# Altium project FuelCell.PrjPcb (part 1 of 3)
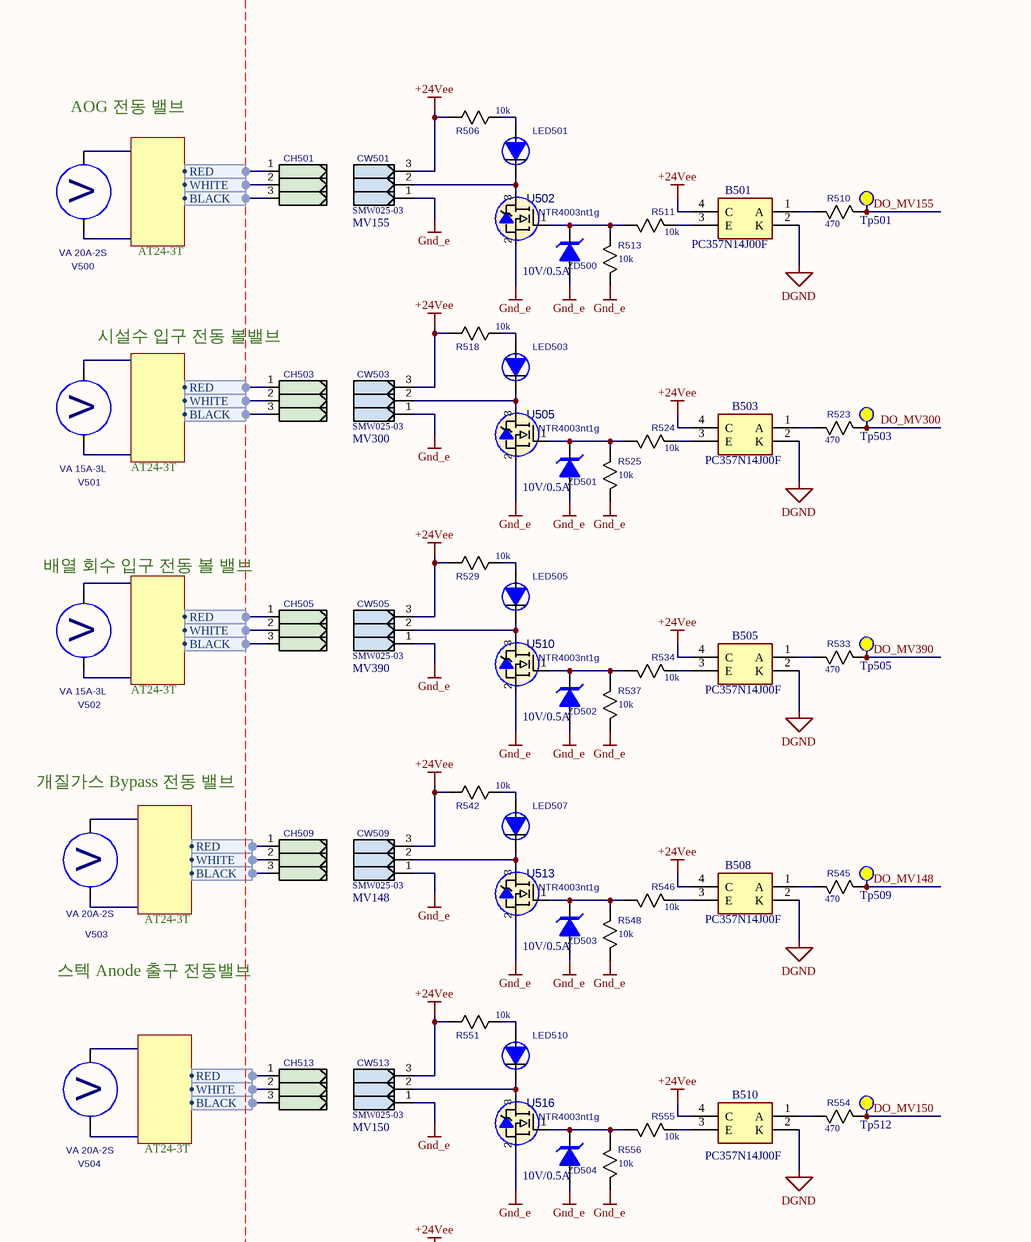
[diagram p0: Output_Section.SchDoc, top left]
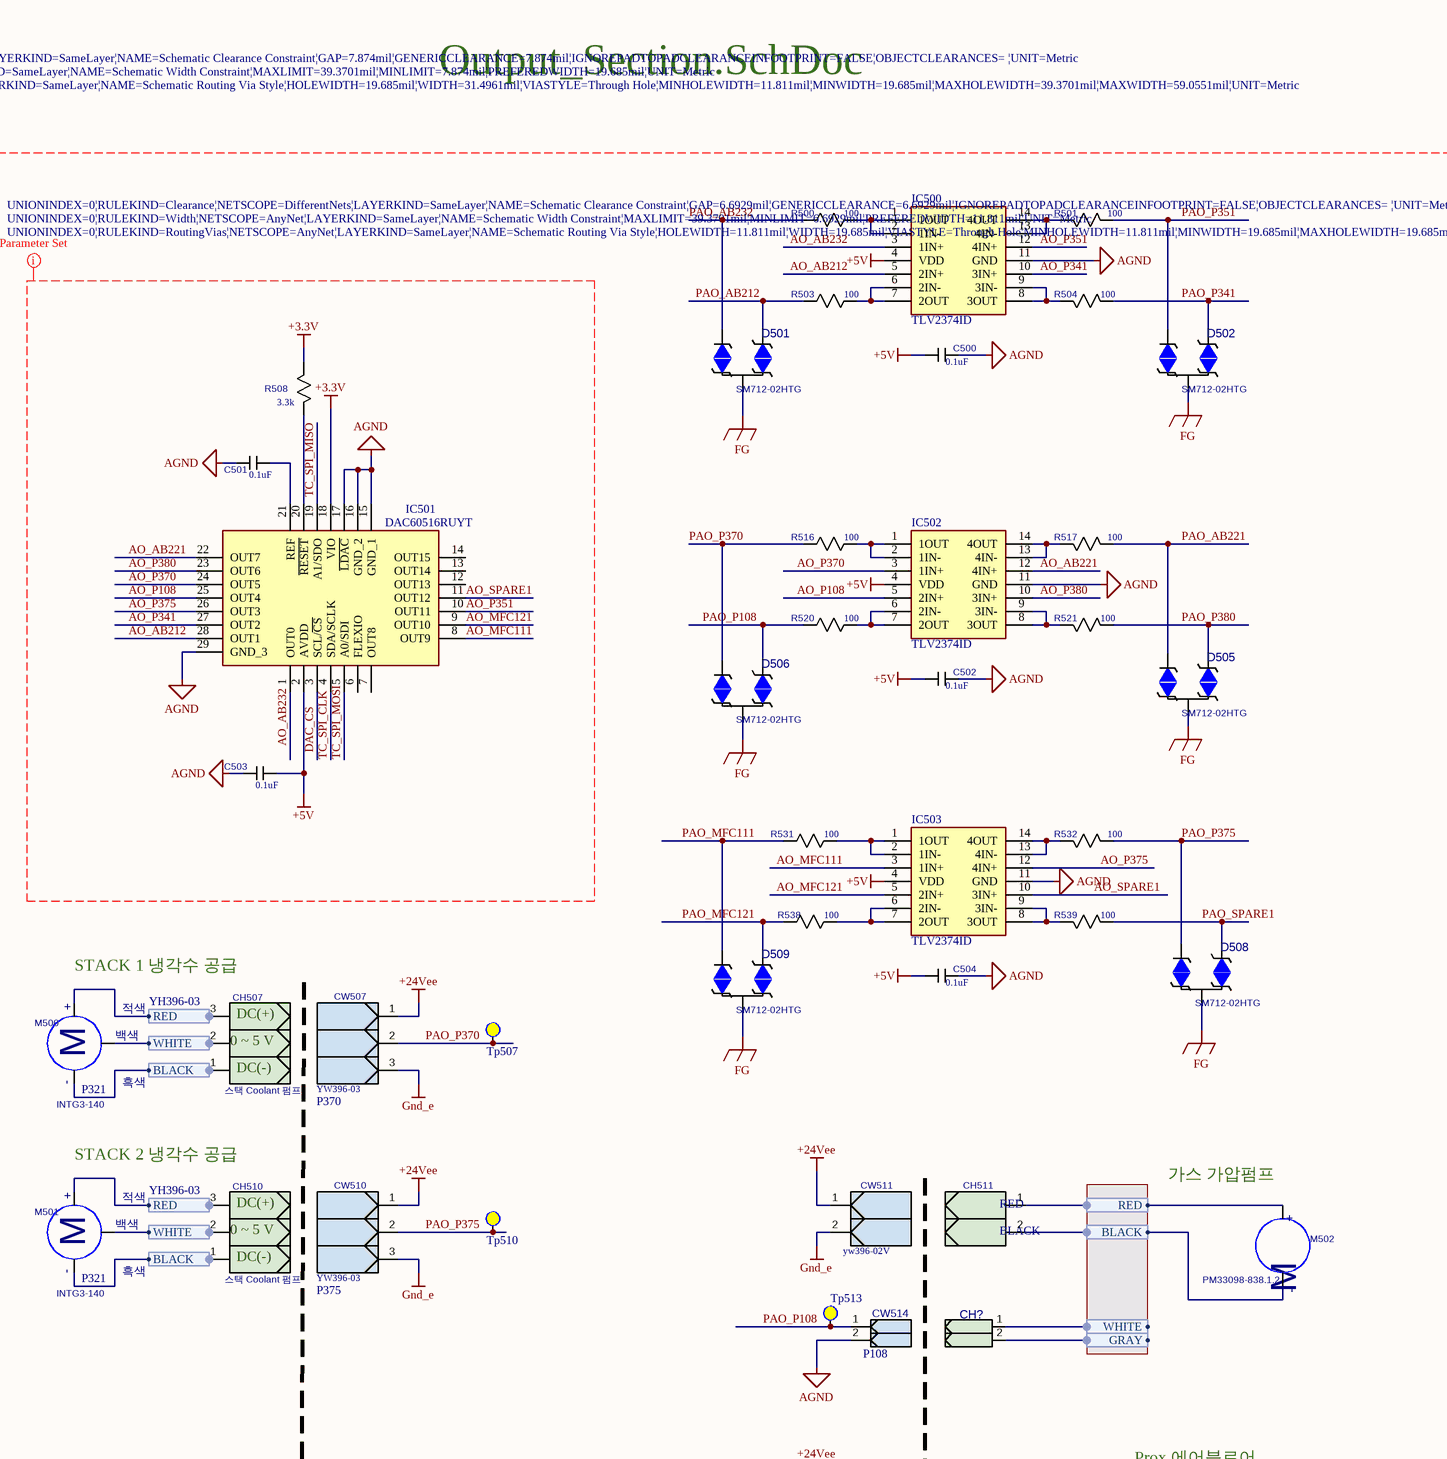
[diagram p1: Output_Section.SchDoc, top middle]
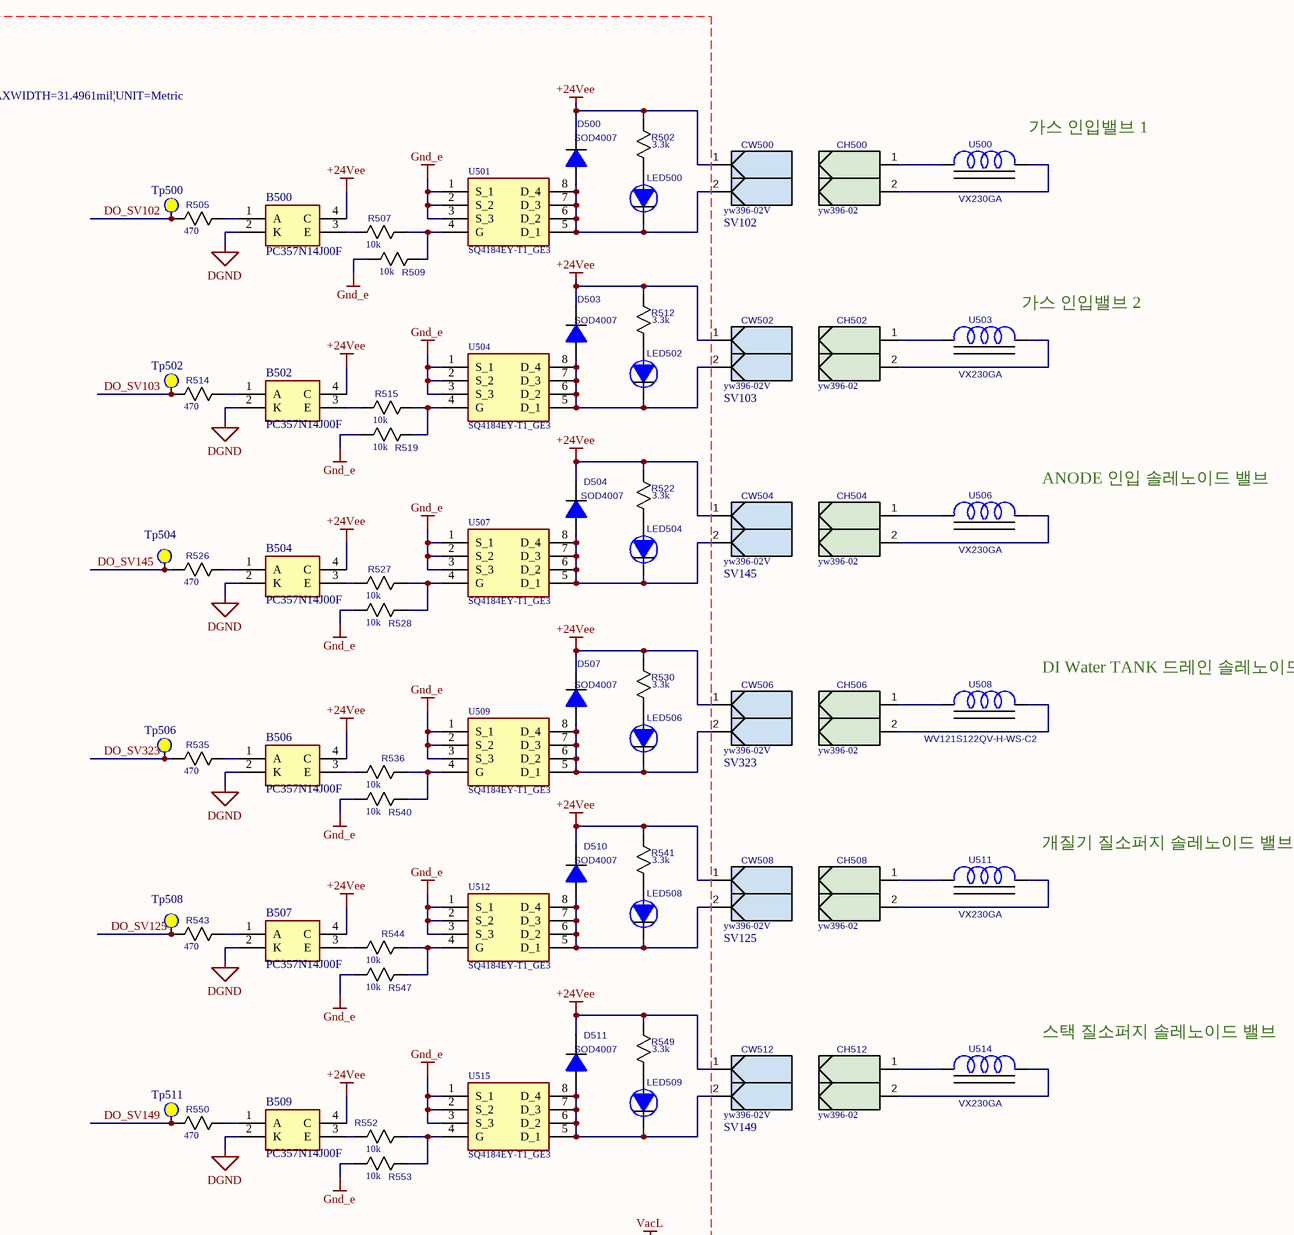
[diagram p2: Output_Section.SchDoc, top right]
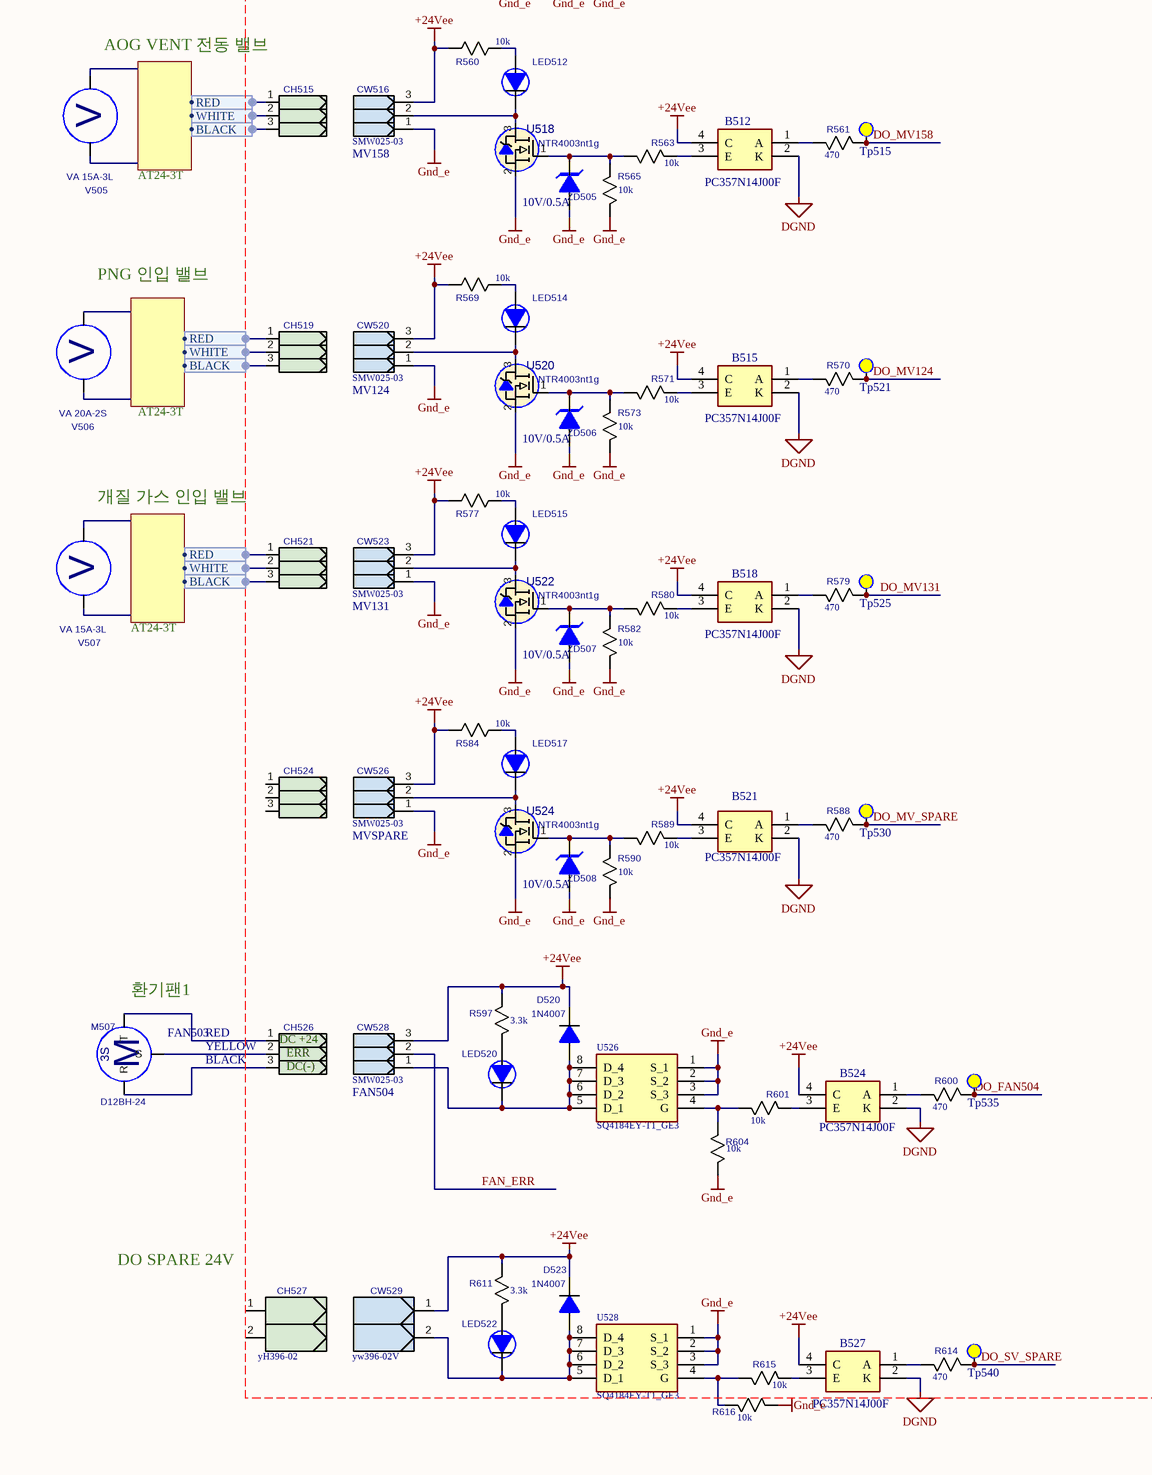
[diagram p3: Output_Section.SchDoc, bottom left]
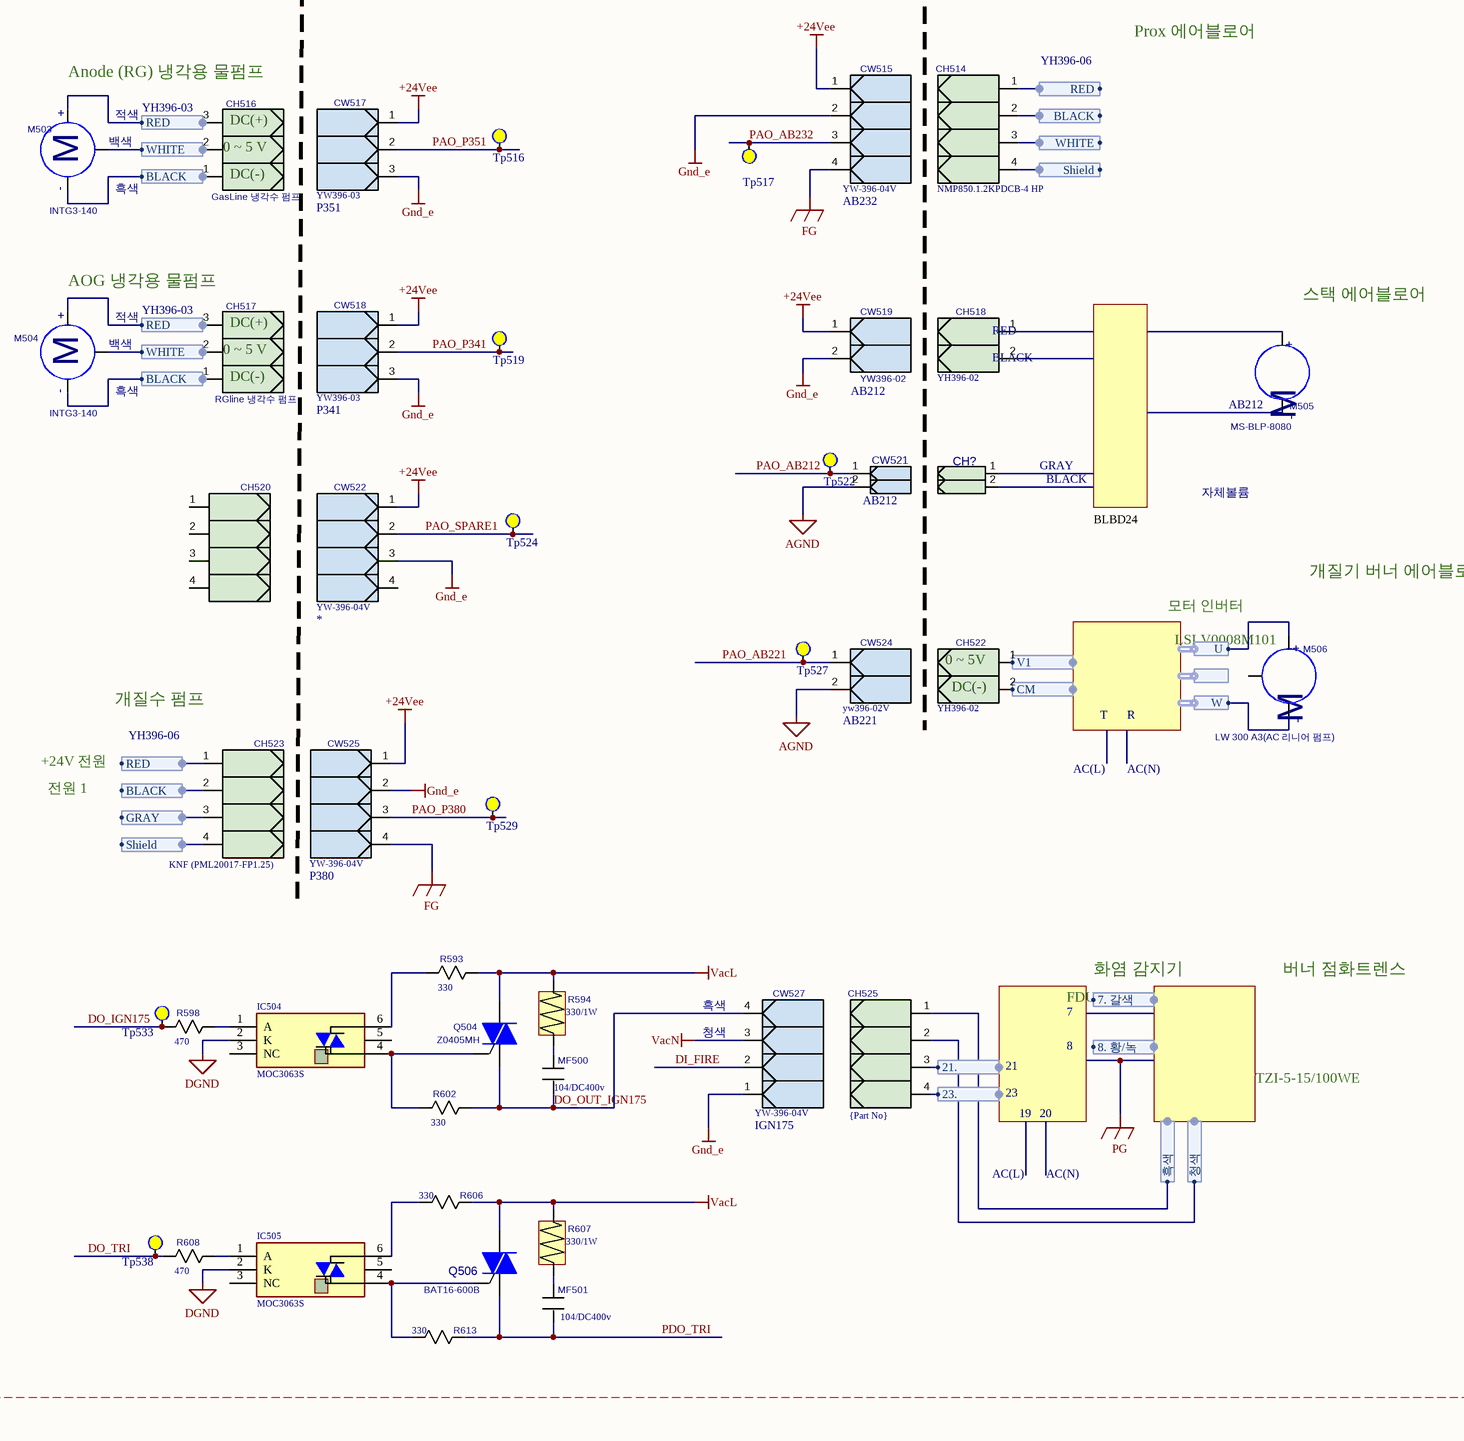
[diagram p4: Output_Section.SchDoc, bottom middle]
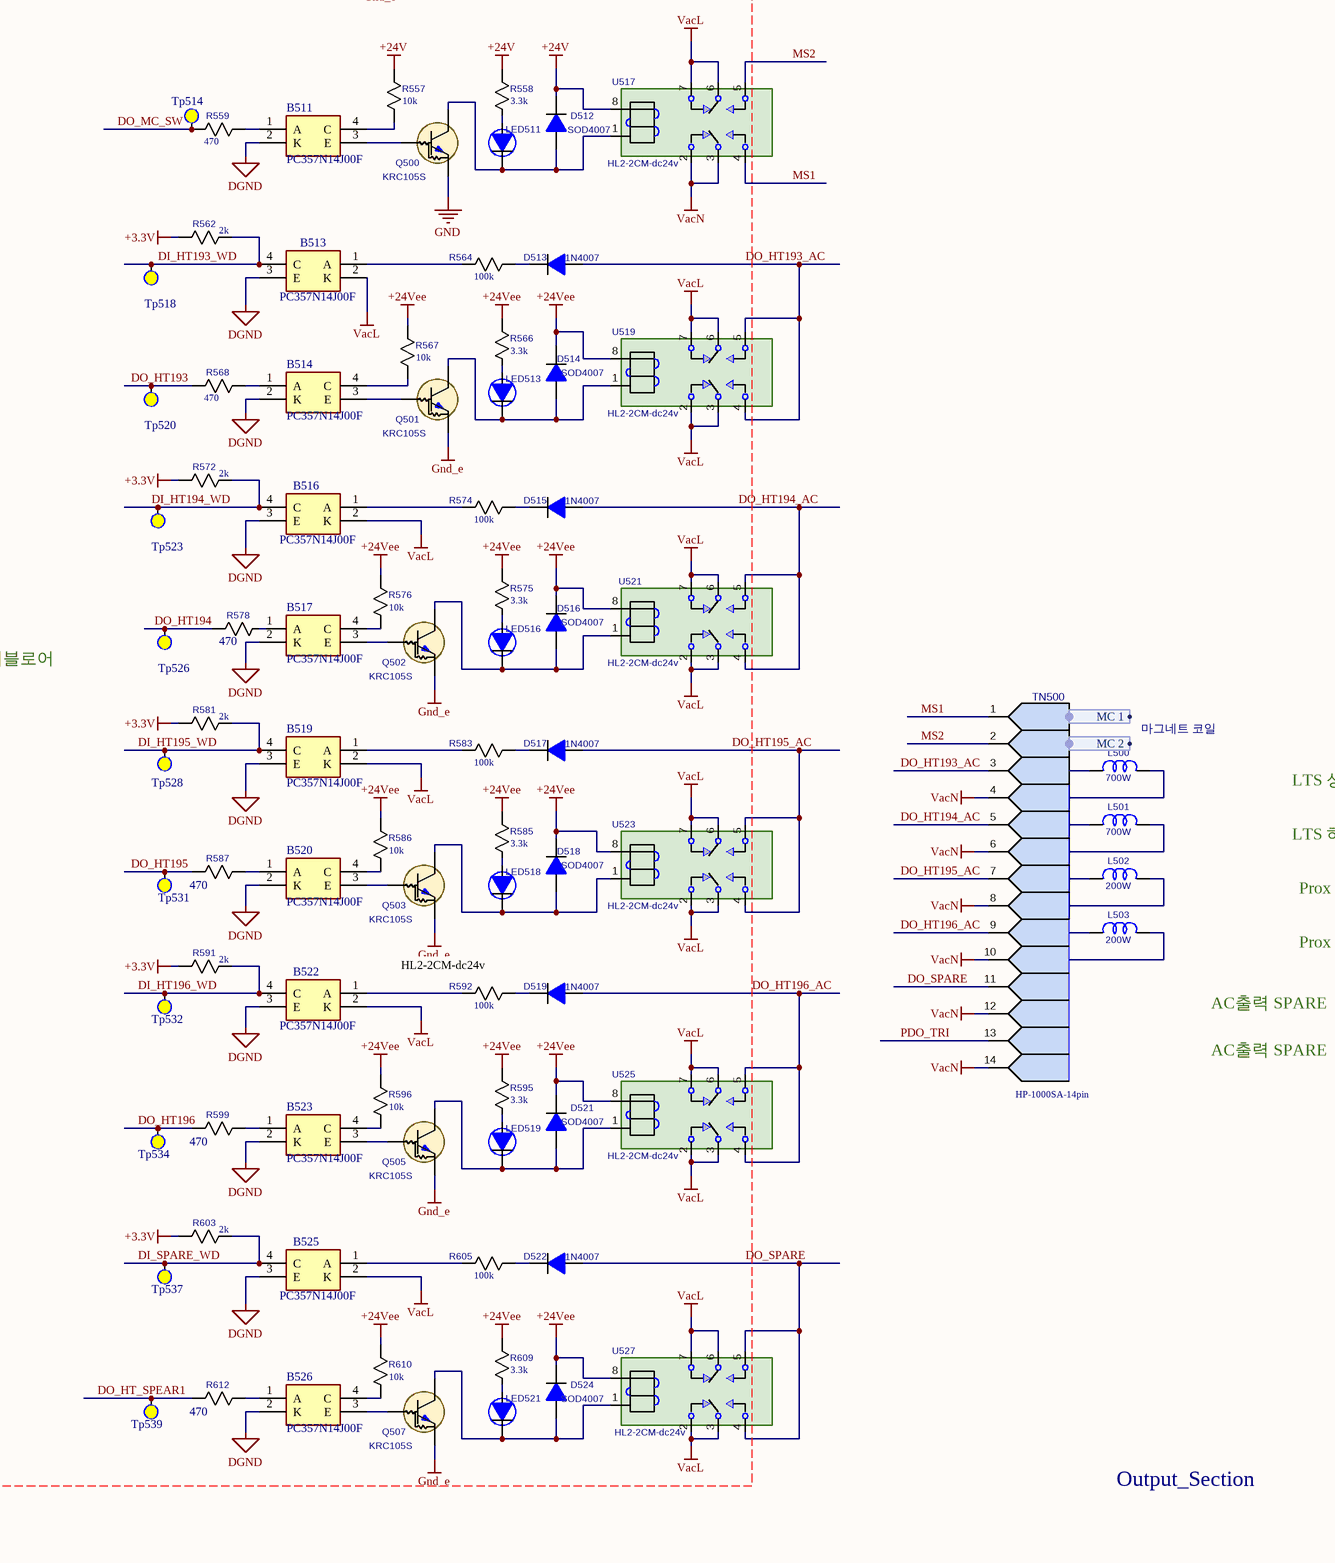
[diagram p5: Output_Section.SchDoc, bottom right]
Compaany: FunnyElecs; VersionRevision: V1.0
6 sheets, 735 parts. Net scope: global (net labels, ports and power ports of the same name join across sheets).
Board file: FuelCell.PcbDoc
Sheets:
  Output_Section.SchDoc
  TempController.SchDoc
  Input_Section.SchDoc
  Mcu.SchDoc
  Ethernet.SchDoc
  Power.SchDoc

## Sheet Output_Section.SchDoc: Output_Section
size A1; Date: 2026-04-27; ApprovedBy: ANBI; CheckedBy: ANBI; CompanyName: DongA Feul Cell; DrawnBy: seokipo; Engineer: seokipo; Revision: 001; SheetNumber: 1; SheetTotal: 6

### Parts
(Parts that share a designator on the sheet are numbered #1, #2 ... from top to bottom, then left to right.)
B500  PC357N14J00F  [SOP254P675X300-4N]
B501  PC357N14J00F  [SOP254P675X300-4N]
B502  PC357N14J00F  [SOP254P675X300-4N]
B503  PC357N14J00F  [SOP254P675X300-4N]
B504  PC357N14J00F  [SOP254P675X300-4N]
B505  PC357N14J00F  [SOP254P675X300-4N]
B506  PC357N14J00F  [SOP254P675X300-4N]
B507  PC357N14J00F  [SOP254P675X300-4N]
B508  PC357N14J00F  [SOP254P675X300-4N]
B509  PC357N14J00F  [SOP254P675X300-4N]
B510  PC357N14J00F  [SOP254P675X300-4N]
B511  PC357N14J00F  [SOP254P675X300-4N]
B512  PC357N14J00F  [SOP254P675X300-4N]
B513  PC357N14J00F  [SOP254P675X300-4N]
B514  PC357N14J00F  [SOP254P675X300-4N]
B515  PC357N14J00F  [SOP254P675X300-4N]
B516  PC357N14J00F  [SOP254P675X300-4N]
B517  PC357N14J00F  [SOP254P675X300-4N]
B518  PC357N14J00F  [SOP254P675X300-4N]
B519  PC357N14J00F  [SOP254P675X300-4N]
B520  PC357N14J00F  [SOP254P675X300-4N]
B521  PC357N14J00F  [SOP254P675X300-4N]
B522  PC357N14J00F  [SOP254P675X300-4N]
B523  PC357N14J00F  [SOP254P675X300-4N]
B524  PC357N14J00F  [SOP254P675X300-4N]
B525  PC357N14J00F  [SOP254P675X300-4N]
B526  PC357N14J00F  [SOP254P675X300-4N]
B527  PC357N14J00F  [SOP254P675X300-4N]
C500  규격: 0.1uF  [CC1608N]  (hidden comment: CS1608)
C501  규격: 0.1uF  [CC1608N]  (hidden comment: CS1608)
C502  규격: 0.1uF  [CC1608N]  (hidden comment: CS1608)
C503  규격: 0.1uF  [CC1608N]  (hidden comment: CS1608)
C504  규격: 0.1uF  [CC1608N]  (hidden comment: CS1608)
CH500  Part No.: yw396-02  (hidden comment: Connect Housing)
CH501  Connect Housing  (value not drawn)
CH502  Part No.: yw396-02  (hidden comment: Connect Housing)
CH503  Connect Housing  (value not drawn)
CH504  Part No.: yw396-02  (hidden comment: Connect Housing)
CH505  Connect Housing  (value not drawn)
CH506  Part No.: yw396-02  (hidden comment: Connect Housing)
CH507  스택 Coolant 펌프
CH508  Part No.: yw396-02  (hidden comment: Connect Housing)
CH509  Connect Housing  (value not drawn)
CH510  스택 Coolant 펌프
CH511  Connect Housing  (value not drawn)
CH512  Part No.: yw396-02  (hidden comment: Connect Housing)
CH513  Connect Housing  (value not drawn)
CH514  Part No.: NMP850.1.2KPDCB-4 HP  (hidden comment: Connect Housing)
CH515  Connect Housing  (value not drawn)
CH516  GasLine 냉각수 펌프
CH517  RGline 냉각수 펌프
CH518  Part No.: YH396-02  (hidden comment: Connect Housing)
CH519  Connect Housing  (value not drawn)
CH520  Connect Housing  (value not drawn)
CH521  Connect Housing  (value not drawn)
CH522  Part No.: YH396-02  (hidden comment: Connect Housing)
CH523  Part No.: KNF (PML20017-FP1.25)  (hidden comment: Connect Housing)
CH524  Connect Housing  (value not drawn)
CH525  Part No.: {Part No}  (hidden comment: Connect Housing)
CH526  Connect Housing  (value not drawn)
CH527  Part No.: yH396-02  (hidden comment: Connect Housing)
CH?#1  Connect Housing  (value not drawn)  (graphical)
CH?#2  Connect Housing  (value not drawn)  (graphical)
CW500  Part No.: yw396-02V  BOP No: SV102  [YW396_02]  (hidden comment: YW396-02)
CW501  Part No.: SMW025-03  BOP No: MV155  [SMW250-03D]  (hidden comment: SMW250-03D)
CW502  Part No.: yw396-02V  BOP No: SV103  [YW396_02]  (hidden comment: YW396-02)
CW503  Part No.: SMW025-03  BOP No: MV300  [SMW250-03D]  (hidden comment: SMW250-03D)
CW504  Part No.: yw396-02V  BOP No: SV145  [YW396_02]  (hidden comment: YW396-02)
CW505  Part No.: SMW025-03  BOP No: MV390  [SMW250-03D]  (hidden comment: SMW250-03D)
CW506  Part No.: yw396-02V  BOP No: SV323  [YW396_02]  (hidden comment: YW396-02)
CW507  BOP No: P370  [YW396_03]  (hidden comment: YW396-03)
CW508  Part No.: yw396-02V  BOP No: SV125  [YW396_02]  (hidden comment: YW396-02)
CW509  Part No.: SMW025-03  BOP No: MV148  [SMW250-03D]  (hidden comment: SMW250-03D)
CW510  BOP No: P375  [YW396_03]  (hidden comment: YW396-03)
CW511  Part No.: yw396-02V  [YW396_02]  (hidden comment: YW396-02)
CW512  Part No.: yw396-02V  BOP No: SV149  [YW396_02]  (hidden comment: YW396-02)
CW513  Part No.: SMW025-03  BOP No: MV150  [SMW250-03D]  (hidden comment: SMW250-03D)
CW514  BOP No: P108  [SMW250-02D]  (hidden comment: SMW250-02D)
CW515  Part No.: YW-396-04V  BOP No: AB232  [YW396_04]  (hidden comment: YW396-04)
CW516  Part No.: SMW025-03  BOP No: MV158  [SMW250-03D]  (hidden comment: SMW250-03D)
CW517  BOP No: P351  [YW396_03]  (hidden comment: YW396-03)
CW518  BOP No: P341  [YW396_03]  (hidden comment: YW396-03)
CW519  YW396-02  BOP No: AB212  [YW396_02]
CW520  Part No.: SMW025-03  BOP No: MV124  [SMW250-03D]  (hidden comment: SMW250-03D)
CW521  BOP No: AB212  [SMW250-02D]  (hidden comment: SMW250-02D)
CW522  Part No.: YW-396-04V  [YW396_04]  (hidden comment: YW396-04)
CW523  Part No.: SMW025-03  BOP No: MV131  [SMW250-03D]  (hidden comment: SMW250-03D)
CW524  Part No.: yw396-02V  BOP No: AB221  [YW396_02]  (hidden comment: YW396-02)
CW525  Part No.: YW-396-04V  BOP No: P380  [YW396_04]  (hidden comment: YW396-04)
CW526  Part No.: SMW025-03  BOP No: MVSPARE  [SMW250-03D]  (hidden comment: SMW250-03D)
CW527  Part No.: YW-396-04V  BOP No: IGN175  [YW396_04]  (hidden comment: YW396-04)
CW528  Part No.: SMW025-03  BOP No: FAN504  [SMW250-03D]  (hidden comment: SMW250-03D)
CW529  Part No.: yw396-02V  [YW396_02]  (hidden comment: YW396-02)
D500  Part No.: SOD4007  [MINI-SMA]  (hidden comment: MINI-SMA)
D501  Part No.: SM712-02HTG  [SOT95P240X115-3N]  (hidden comment: TVS5025)
D502  Part No.: SM712-02HTG  [SOT95P240X115-3N]  (hidden comment: TVS5025)
D503  Part No.: SOD4007  [MINI-SMA]  (hidden comment: MINI-SMA)
D504  Part No.: SOD4007  [MINI-SMA]  (hidden comment: MINI-SMA)
D505  Part No.: SM712-02HTG  [SOT95P240X115-3N]  (hidden comment: TVS5025)
D506  Part No.: SM712-02HTG  [SOT95P240X115-3N]  (hidden comment: TVS5025)
D507  Part No.: SOD4007  [MINI-SMA]  (hidden comment: MINI-SMA)
D508  Part No.: SM712-02HTG  [SOT95P240X115-3N]  (hidden comment: TVS5025)
D509  Part No.: SM712-02HTG  [SOT95P240X115-3N]  (hidden comment: TVS5025)
D510  Part No.: SOD4007  [MINI-SMA]  (hidden comment: MINI-SMA)
D511  Part No.: SOD4007  [MINI-SMA]  (hidden comment: MINI-SMA)
D512  Part No.: SOD4007  [MINI-SMA]  (hidden comment: MINI-SMA)
D513  Part No.: 1N4007  [MINI-SMA]  (hidden comment: MINI-SMA)
D514  Part No.: SOD4007  [MINI-SMA]  (hidden comment: MINI-SMA)
D515  Part No.: 1N4007  [MINI-SMA]  (hidden comment: MINI-SMA)
D516  Part No.: SOD4007  [MINI-SMA]  (hidden comment: MINI-SMA)
D517  Part No.: 1N4007  [MINI-SMA]  (hidden comment: MINI-SMA)
D518  Part No.: SOD4007  [MINI-SMA]  (hidden comment: MINI-SMA)
D519  Part No.: 1N4007  [MINI-SMA]  (hidden comment: MINI-SMA)
D520  Part No.: 1N4007  [MINI-SMA]  (hidden comment: MINI-SMA)
D521  Part No.: SOD4007  [MINI-SMA]  (hidden comment: MINI-SMA)
D522  Part No.: 1N4007  [MINI-SMA]  (hidden comment: MINI-SMA)
D523  Part No.: 1N4007  [MINI-SMA]  (hidden comment: MINI-SMA)
D524  Part No.: SOD4007  [MINI-SMA]  (hidden comment: MINI-SMA)
IC500  TLV2374ID  [SOIC127P600X175-14N]
IC501  DAC60516RUYT  [QFN40P400X400X80-29N-D]
IC502  TLV2374ID  [SOIC127P600X175-14N]
IC503  TLV2374ID  [SOIC127P600X175-14N]
IC504  MOC3063S  [SOT254P1016X460-6N]
IC505  MOC3063S  [SOT254P1016X460-6N]
L500  Part No.: 700W  (hidden comment: HEAT)
L501  Part No.: 700W  (hidden comment: HEAT)
L502  Part No.: 200W  (hidden comment: HEAT)
L503  Part No.: 200W  (hidden comment: HEAT)
LED500  LED1608  [LED1608]  (value not drawn)
LED501  LED1608  [LED1608]  (value not drawn)
LED502  LED1608  [LED1608]  (value not drawn)
LED503  LED1608  [LED1608]  (value not drawn)
LED504  LED1608  [LED1608]  (value not drawn)
LED505  LED1608  [LED1608]  (value not drawn)
LED506  LED1608  [LED1608]  (value not drawn)
LED507  LED1608  [LED1608]  (value not drawn)
LED508  LED1608  [LED1608]  (value not drawn)
LED509  LED1608  [LED1608]  (value not drawn)
LED510  LED1608  [LED1608]  (value not drawn)
LED511  LED1608  [LED1608]  (value not drawn)
LED512  LED1608  [LED1608]  (value not drawn)
LED513  LED1608  [LED1608]  (value not drawn)
LED514  LED1608  [LED1608]  (value not drawn)
LED515  LED1608  [LED1608]  (value not drawn)
LED516  LED1608  [LED1608]  (value not drawn)
LED517  LED1608  [LED1608]  (value not drawn)
LED518  LED1608  [LED1608]  (value not drawn)
LED519  LED1608  [LED1608]  (value not drawn)
LED520  LED1608  [LED1608]  (value not drawn)
LED521  LED1608  [LED1608]  (value not drawn)
LED522  LED1608  [LED1608]  (value not drawn)
M500  Part No.: INTG3-140  BOP No: P321  (hidden comment: MOTOR_3S)
M501  Part No.: INTG3-140  BOP No: P321  (hidden comment: MOTOR_3S)
M502  Part No.: PM33098-838.1.2  (hidden comment: MOTOR_3S)
M503  Part No.: INTG3-140  (hidden comment: MOTOR_3S)
M504  Part No.: INTG3-140  (hidden comment: MOTOR_3S)
M505  Part No.: MS-BLP-8080  BOP No: AB212  (hidden comment: MOTOR_3S)
M506  Part No.: LW 300 A3(AC 리니어 펌프)  (hidden comment: MOTOR_3S)
M507  Part No.: D12BH-24  BOP No: FAN503  (hidden comment: MOTOR_3S)
MF500  규격: 104/DC400v  [MF_104_Filkor]  (hidden comment: MF104_FLIKO)
MF501  규격: 104/DC400v  [MF_104_Filkor]  (hidden comment: MF104_FLIKO)
Q500  Part No.: KRC105S  [SOT-23]  (hidden comment: TR23RN)
Q501  Part No.: KRC105S  [SOT-23]  (hidden comment: TR23RN)
Q502  Part No.: KRC105S  [SOT-23]  (hidden comment: TR23RN)
Q503  Part No.: KRC105S  [SOT-23]  (hidden comment: TR23RN)
Q504  Part No.: Z0405MH  [TO-220S]  (hidden comment: TRIAC_220S)
Q505  Part No.: KRC105S  [SOT-23]  (hidden comment: TR23RN)
Q506  Part No.: BAT16-600B  [TO-220-HT]  (hidden comment: TRIAC_220HT)
Q507  Part No.: KRC105S  [SOT-23]  (hidden comment: TR23RN)
R500  규격: 100  [RESC1608X55N]  (hidden comment: R1608)
R501  규격: 100  [RESC1608X55N]  (hidden comment: R1608)
R502  규격: 3.3k  [RESC1608X55N]  (hidden comment: R1608)
R503  규격: 100  [RESC1608X55N]  (hidden comment: R1608)
R504  규격: 100  [RESC1608X55N]  (hidden comment: R1608)
R505  규격: 470  [RESC1608X55N]  (hidden comment: R1608)
R506  규격: 10k  [RESC1608X55N]  (hidden comment: R1608)
R507  규격: 10k  [RESC1608X55N]  (hidden comment: R1608)
R508  규격: 3.3k  [RESC1608X55N]  (hidden comment: R1608)
R509  규격: 10k  [RESC1608X55N]  (hidden comment: R1608)
R510  규격: 470  [RESC1608X55N]  (hidden comment: R1608)
R511  규격: 10k  [RESC1608X55N]  (hidden comment: R1608)
R512  규격: 3.3k  [RESC1608X55N]  (hidden comment: R1608)
R513  규격: 10k  [RESC1608X55N]  (hidden comment: R1608)
R514  규격: 470  [RESC1608X55N]  (hidden comment: R1608)
R515  규격: 10k  [RESC1608X55N]  (hidden comment: R1608)
R516  규격: 100  [RESC1608X55N]  (hidden comment: R1608)
R517  규격: 100  [RESC1608X55N]  (hidden comment: R1608)
R518  규격: 10k  [RESC1608X55N]  (hidden comment: R1608)
R519  규격: 10k  [RESC1608X55N]  (hidden comment: R1608)
R520  규격: 100  [RESC1608X55N]  (hidden comment: R1608)
R521  규격: 100  [RESC1608X55N]  (hidden comment: R1608)
R522  규격: 3.3k  [RESC1608X55N]  (hidden comment: R1608)
R523  규격: 470  [RESC1608X55N]  (hidden comment: R1608)
R524  규격: 10k  [RESC1608X55N]  (hidden comment: R1608)
R525  규격: 10k  [RESC1608X55N]  (hidden comment: R1608)
R526  규격: 470  [RESC1608X55N]  (hidden comment: R1608)
R527  규격: 10k  [RESC1608X55N]  (hidden comment: R1608)
R528  규격: 10k  [RESC1608X55N]  (hidden comment: R1608)
R529  규격: 10k  [RESC1608X55N]  (hidden comment: R1608)
R530  규격: 3.3k  [RESC1608X55N]  (hidden comment: R1608)
R531  규격: 100  [RESC1608X55N]  (hidden comment: R1608)
R532  규격: 100  [RESC1608X55N]  (hidden comment: R1608)
R533  규격: 470  [RESC1608X55N]  (hidden comment: R1608)
R534  규격: 10k  [RESC1608X55N]  (hidden comment: R1608)
R535  규격: 470  [RESC1608X55N]  (hidden comment: R1608)
R536  규격: 10k  [RESC1608X55N]  (hidden comment: R1608)
R537  규격: 10k  [RESC1608X55N]  (hidden comment: R1608)
R538  규격: 100  [RESC1608X55N]  (hidden comment: R1608)
R539  규격: 100  [RESC1608X55N]  (hidden comment: R1608)
R540  규격: 10k  [RESC1608X55N]  (hidden comment: R1608)
R541  규격: 3.3k  [RESC1608X55N]  (hidden comment: R1608)
R542  규격: 10k  [RESC1608X55N]  (hidden comment: R1608)
R543  규격: 470  [RESC1608X55N]  (hidden comment: R1608)
R544  규격: 10k  [RESC1608X55N]  (hidden comment: R1608)
R545  규격: 470  [RESC1608X55N]  (hidden comment: R1608)
R546  규격: 10k  [RESC1608X55N]  (hidden comment: R1608)
R547  규격: 10k  [RESC1608X55N]  (hidden comment: R1608)
R548  규격: 10k  [RESC1608X55N]  (hidden comment: R1608)
R549  규격: 3.3k  [RESC1608X55N]  (hidden comment: R1608)
R550  규격: 470  [RESC1608X55N]  (hidden comment: R1608)
R551  규격: 10k  [RESC1608X55N]  (hidden comment: R1608)
R552  규격: 10k  [RESC1608X55N]  (hidden comment: R1608)
R553  규격: 10k  [RESC1608X55N]  (hidden comment: R1608)
R554  규격: 470  [RESC1608X55N]  (hidden comment: R1608)
R555  규격: 10k  [RESC1608X55N]  (hidden comment: R1608)
R556  규격: 10k  [RESC1608X55N]  (hidden comment: R1608)
R557  규격: 10k  [RESC1608X55N]  (hidden comment: R1608)
R558  규격: 3.3k  [RESC1608X55N]  (hidden comment: R1608)
R559  규격: 470  [RESC1608X55N]  (hidden comment: R1608)
R560  규격: 10k  [RESC1608X55N]  (hidden comment: R1608)
R561  규격: 470  [RESC1608X55N]  (hidden comment: R1608)
R562  규격: 2k  [RESC1608X55N]  (hidden comment: R1608)
R563  규격: 10k  [RESC1608X55N]  (hidden comment: R1608)
R564  규격: 100k  [RESC1608X55N]  (hidden comment: R1608)
R565  규격: 10k  [RESC1608X55N]  (hidden comment: R1608)
R566  규격: 3.3k  [RESC1608X55N]  (hidden comment: R1608)
R567  규격: 10k  [RESC1608X55N]  (hidden comment: R1608)
R568  규격: 470  [RESC1608X55N]  (hidden comment: R1608)
R569  규격: 10k  [RESC1608X55N]  (hidden comment: R1608)
R570  규격: 470  [RESC1608X55N]  (hidden comment: R1608)
R571  규격: 10k  [RESC1608X55N]  (hidden comment: R1608)
R572  규격: 2k  [RESC1608X55N]  (hidden comment: R1608)
R573  규격: 10k  [RESC1608X55N]  (hidden comment: R1608)
R574  규격: 100k  [RESC1608X55N]  (hidden comment: R1608)
R575  규격: 3.3k  [RESC1608X55N]  (hidden comment: R1608)
R576  규격: 10k  [RESC1608X55N]  (hidden comment: R1608)
R577  규격: 10k  [RESC1608X55N]  (hidden comment: R1608)
R578  규격: 470  [RESC1608X55N]  (hidden comment: R1608)
R579  규격: 470  [RESC1608X55N]  (hidden comment: R1608)
R580  규격: 10k  [RESC1608X55N]  (hidden comment: R1608)
R581  규격: 2k  [RESC1608X55N]  (hidden comment: R1608)
R582  규격: 10k  [RESC1608X55N]  (hidden comment: R1608)
R583  규격: 100k  [RESC1608X55N]  (hidden comment: R1608)
R584  규격: 10k  [RESC1608X55N]  (hidden comment: R1608)
R585  규격: 3.3k  [RESC1608X55N]  (hidden comment: R1608)
R586  규격: 10k  [RESC1608X55N]  (hidden comment: R1608)
R587  규격: 470  [RESC1608X55N]  (hidden comment: R1608)
R588  규격: 470  [RESC1608X55N]  (hidden comment: R1608)
R589  규격: 10k  [RESC1608X55N]  (hidden comment: R1608)
R590  규격: 10k  [RESC1608X55N]  (hidden comment: R1608)
R591  규격: 2k  [RESC1608X55N]  (hidden comment: R1608)
R592  규격: 100k  [RESC1608X55N]  (hidden comment: R1608)
R593  규격: 330  [R3216]  (hidden comment: R3216)
R594  규격: 330/1W  [R1_2]  (hidden comment: R1_1)
R595  규격: 3.3k  [RESC1608X55N]  (hidden comment: R1608)
R596  규격: 10k  [RESC1608X55N]  (hidden comment: R1608)
R597  규격: 3.3k  [RESC1608X55N]  (hidden comment: R1608)
R598  규격: 470  [RESC1608X55N]  (hidden comment: R1608)
R599  규격: 470  [RESC1608X55N]  (hidden comment: R1608)
R600  규격: 470  [RESC1608X55N]  (hidden comment: R1608)
R601  규격: 10k  [RESC1608X55N]  (hidden comment: R1608)
R602  규격: 330  [R3216]  (hidden comment: R3216)
R603  규격: 2k  [RESC1608X55N]  (hidden comment: R1608)
R604  규격: 10k  [RESC1608X55N]  (hidden comment: R1608)
R605  규격: 100k  [RESC1608X55N]  (hidden comment: R1608)
R606  규격: 330  [R3216]  (hidden comment: R3216)
R607  규격: 330/1W  [R1_2]  (hidden comment: R1_1)
R608  규격: 470  [RESC1608X55N]  (hidden comment: R1608)
R609  규격: 3.3k  [RESC1608X55N]  (hidden comment: R1608)
R610  규격: 10k  [RESC1608X55N]  (hidden comment: R1608)
R611  규격: 3.3k  [RESC1608X55N]  (hidden comment: R1608)
R612  규격: 470  [RESC1608X55N]  (hidden comment: R1608)
R613  규격: 330  [R3216]  (hidden comment: R3216)
R614  규격: 470  [RESC1608X55N]  (hidden comment: R1608)
R615  규격: 10k  [RESC1608X55N]  (hidden comment: R1608)
R616  규격: 10k  [RESC1608X55N]  (hidden comment: R1608)
TN500  Part No.: HP-1000SA-14pin  [TERMINAL_10_14]  (hidden comment: TERMINAL-10PIN)
Tp500  Test Point_top  [TP_KEYSTONE_5000]  (value not drawn)
Tp501  Test Point_top  [TP_KEYSTONE_5000]  (value not drawn)
Tp502  Test Point_top  [TP_KEYSTONE_5000]  (value not drawn)
Tp503  Test Point_top  [TP_KEYSTONE_5000]  (value not drawn)
Tp504  Test Point_top  [TP_KEYSTONE_5000]  (value not drawn)
Tp505  Test Point_top  [TP_KEYSTONE_5000]  (value not drawn)
Tp506  Test Point_top  [TP_KEYSTONE_5000]  (value not drawn)
Tp507  Test Point_top  [TP_KEYSTONE_5000]  (value not drawn)
Tp508  Test Point_top  [TP_KEYSTONE_5000]  (value not drawn)
Tp509  Test Point_top  [TP_KEYSTONE_5000]  (value not drawn)
Tp510  Test Point_top  [TP_KEYSTONE_5000]  (value not drawn)
Tp511  Test Point_top  [TP_KEYSTONE_5000]  (value not drawn)
Tp512  Test Point_top  [TP_KEYSTONE_5000]  (value not drawn)
Tp513  Test Point_top  [TP_KEYSTONE_5000]  (value not drawn)
Tp514  Test Point_top  [TP_KEYSTONE_5000]  (value not drawn)
Tp515  Test Point_top  [TP_KEYSTONE_5000]  (value not drawn)
Tp516  Test Point_top  [TP_KEYSTONE_5000]  (value not drawn)
Tp517  Test Point_top  [TP_KEYSTONE_5000]  (value not drawn)
Tp518  Test Point_top  [TP_KEYSTONE_5000]  (value not drawn)
Tp519  Test Point_top  [TP_KEYSTONE_5000]  (value not drawn)
Tp520  Test Point_top  [TP_KEYSTONE_5000]  (value not drawn)
Tp521  Test Point_top  [TP_KEYSTONE_5000]  (value not drawn)
Tp522  Test Point_top  [TP_KEYSTONE_5000]  (value not drawn)
Tp523  Test Point_top  [TP_KEYSTONE_5000]  (value not drawn)
Tp524  Test Point_top  [TP_KEYSTONE_5000]  (value not drawn)
Tp525  Test Point_top  [TP_KEYSTONE_5000]  (value not drawn)
Tp526  Test Point_top  [TP_KEYSTONE_5000]  (value not drawn)
Tp527  Test Point_top  [TP_KEYSTONE_5000]  (value not drawn)
Tp528  Test Point_top  [TP_KEYSTONE_5000]  (value not drawn)
Tp529  Test Point_top  [TP_KEYSTONE_5000]  (value not drawn)
Tp530  Test Point_top  [TP_KEYSTONE_5000]  (value not drawn)
Tp531  Test Point_top  [TP_KEYSTONE_5000]  (value not drawn)
Tp532  Test Point_top  [TP_KEYSTONE_5000]  (value not drawn)
Tp533  Test Point_top  [TP_KEYSTONE_5000]  (value not drawn)
Tp534  Test Point_top  [TP_KEYSTONE_5000]  (value not drawn)
Tp535  Test Point_top  [TP_KEYSTONE_5000]  (value not drawn)
Tp537  Test Point_top  [TP_KEYSTONE_5000]  (value not drawn)
Tp538  Test Point_top  [TP_KEYSTONE_5000]  (value not drawn)
Tp539  Test Point_top  [TP_KEYSTONE_5000]  (value not drawn)
Tp540  Test Point_top  [TP_KEYSTONE_5000]  (value not drawn)
U500  Part No.: VX230GA  (hidden comment: COIL)
U501  Part No.: SQ4184EY-T1_GE3  [SOIC127P600X175-8N]  (hidden comment: FET_IRF7413)
U502  Part No.: NTR4003nt1g  [SOT-23]  (hidden comment: FET23_N)
U503  Part No.: VX230GA  (hidden comment: COIL)
U504  Part No.: SQ4184EY-T1_GE3  [SOIC127P600X175-8N]  (hidden comment: FET_IRF7413)
U505  Part No.: NTR4003nt1g  [SOT-23]  (hidden comment: FET23_N)
U506  Part No.: VX230GA  (hidden comment: COIL)
U507  Part No.: SQ4184EY-T1_GE3  [SOIC127P600X175-8N]  (hidden comment: FET_IRF7413)
U508  Part No.: WV121S122QV-H-WS-C2  (hidden comment: COIL)
U509  Part No.: SQ4184EY-T1_GE3  [SOIC127P600X175-8N]  (hidden comment: FET_IRF7413)
U510  Part No.: NTR4003nt1g  [SOT-23]  (hidden comment: FET23_N)
U511  Part No.: VX230GA  (hidden comment: COIL)
U512  Part No.: SQ4184EY-T1_GE3  [SOIC127P600X175-8N]  (hidden comment: FET_IRF7413)
U513  Part No.: NTR4003nt1g  [SOT-23]  (hidden comment: FET23_N)
U514  Part No.: VX230GA  (hidden comment: COIL)
U515  Part No.: SQ4184EY-T1_GE3  [SOIC127P600X175-8N]  (hidden comment: FET_IRF7413)
U516  Part No.: NTR4003nt1g  [SOT-23]  (hidden comment: FET23_N)
U517  Part No.: HL2-2CM-dc24v  [HL2-2CM]  (hidden comment: RY_HL2-2CM)
U518  Part No.: NTR4003nt1g  [SOT-23]  (hidden comment: FET23_N)
U519  Part No.: HL2-2CM-dc24v  [HL2-2CM]  (hidden comment: RY_HL2-2CM)
U520  Part No.: NTR4003nt1g  [SOT-23]  (hidden comment: FET23_N)
U521  Part No.: HL2-2CM-dc24v  [HL2-2CM]  (hidden comment: RY_HL2-2CM)
U522  Part No.: NTR4003nt1g  [SOT-23]  (hidden comment: FET23_N)
U523  Part No.: HL2-2CM-dc24v  [HL2-2CM]  (hidden comment: RY_HL2-2CM)
U524  Part No.: NTR4003nt1g  [SOT-23]  (hidden comment: FET23_N)
U525  Part No.: HL2-2CM-dc24v  [HL2-2CM]  (hidden comment: RY_HL2-2CM)
U526  Part No.: SQ4184EY-T1_GE3  [SOIC127P600X175-8N]  (hidden comment: FET_IRF7413)
U527  Part No.: HL2-2CM-dc24v  [HL2-2CM]  (hidden comment: RY_HL2-2CM)
U528  Part No.: SQ4184EY-T1_GE3  [SOIC127P600X175-8N]  (hidden comment: FET_IRF7413)
V500  Part No.: VA 20A-2S  (hidden comment: MOTOR_3S)
V501  Part No.: VA 15A-3L  (hidden comment: MOTOR_3S)
V502  Part No.: VA 15A-3L  (hidden comment: MOTOR_3S)
V503  Part No.: VA 20A-2S  (hidden comment: MOTOR_3S)
V504  Part No.: VA 20A-2S  (hidden comment: MOTOR_3S)
V505  Part No.: VA 15A-3L  (hidden comment: MOTOR_3S)
V506  Part No.: VA 20A-2S  (hidden comment: MOTOR_3S)
V507  Part No.: VA 15A-3L  (hidden comment: MOTOR_3S)
ZD500  value 10V/0.5A  [ZD3216M]  (hidden comment: ZD_3216)
ZD501  value 10V/0.5A  [ZD3216M]  (hidden comment: ZD_3216)
ZD502  value 10V/0.5A  [ZD3216M]  (hidden comment: ZD_3216)
ZD503  value 10V/0.5A  [ZD3216M]  (hidden comment: ZD_3216)
ZD504  value 10V/0.5A  [ZD3216M]  (hidden comment: ZD_3216)
ZD505  value 10V/0.5A  [ZD3216M]  (hidden comment: ZD_3216)
ZD506  value 10V/0.5A  [ZD3216M]  (hidden comment: ZD_3216)
ZD507  value 10V/0.5A  [ZD3216M]  (hidden comment: ZD_3216)
ZD508  value 10V/0.5A  [ZD3216M]  (hidden comment: ZD_3216)

### Harnesses
YH396-06: RED
?: BLACK
?: GRAY
?: Shield
YH396-03: RED
?: WHITE
?: RED
?: U
?: 
?: W
?: V1
?: CM
마그네트 코일: MC 1
?: MC 2
?: 21.
?: 23.
?: 7. 갈색
?: 8. 황/녹
?: 흑색
?: 청색

### Nets
+3.3V: IC501.18(VIO) R508.2 R562.1 R572.1 R581.1 R591.1 R603.1
+5V: C500.1 C502.1 C503.1 C504.1 IC500.4(VDD) IC501.2(AVDD) IC502.4(VDD) IC503.4(VDD)
+24V: D512.2 R557.2 R558.2 U517.8(coil-)
+24Vee: B500.4(C) B501.4(C) B502.4(C) B503.4(C) B504.4(C) B505.4(C) B506.4(C) B507.4(C) B508.4(C) B509.4(C) B510.4(C) B512.4(C) B515.4(C) B518.4(C) B521.4(C) B524.4(C) B527.4(C) CW500.1 CW501.3 CW502.1 CW503.3 CW504.1 CW505.3 CW506.1 CW507.1 CW508.1 CW509.3 CW510.1 CW511.1 CW512.1 CW513.3 CW515.1 CW516.3 CW517.1 CW518.1 CW519.1 CW520.3 CW522.1 CW523.3 CW525.1 CW526.3 CW528.3 CW529.1 D500.2 D503.2 D504.2 D507.2 D510.2 D511.2 D514.2 D516.2 D518.2 D520.2 D521.2 D523.2 D524.2 R502.2 R506.2 R512.2 R518.2 R522.2 R529.2 R530.2 R541.2 R542.2 R549.2 R551.2 R560.2 R566.2 R567.2 R569.2 R575.2 R576.2 R577.2 R584.2 R585.2 R586.2 R595.2 R596.2 R597.2 R609.2 R610.2 R611.2 U519.8(coil-) U521.8(coil-) U523.8(coil-) U525.8(coil-) U527.8(coil-)
AGND: C500.2 C501.2 C502.2 C503.2 C504.2 CW514.2 CW521.2 CW524.2 IC500.11(GND) IC501.15(GND_1) IC501.16(GND_2) IC501.17(~{LDAC}) IC501.29(GND_3) IC502.11(GND) IC503.11(GND)
DGND: B500.2(K) B501.2(K) B502.2(K) B503.2(K) B504.2(K) B505.2(K) B506.2(K) B507.2(K) B508.2(K) B509.2(K) B510.2(K) B511.2(K) B512.2(K) B513.3(E) B514.2(K) B515.2(K) B516.3(E) B517.2(K) B518.2(K) B519.3(E) B520.2(K) B521.2(K) B522.3(E) B523.2(K) B524.2(K) B525.3(E) B526.2(K) B527.2(K) IC504.2(K) IC505.2(K)
FG: CW515.4 CW525.4 D501.3 D502.3 D505.3 D506.3 D508.3 D509.3
GND: Q500.2(E)
Gnd_e: CW501.1 CW503.1 CW505.1 CW507.3 CW509.1 CW510.3 CW511.2 CW513.1 CW515.2 CW516.1 CW517.3 CW518.3 CW519.2 CW520.1 CW522.3 CW523.1 CW525.2 CW526.1 CW527.1 Q501.2(E) Q502.2(E) Q503.2(E) Q505.2(E) Q507.2(E) R509.2 R513.2 R519.2 R525.2 R528.2 R537.2 R540.2 R547.2 R548.2 R553.2 R556.2 R565.2 R573.2 R582.2 R590.2 R604.2 R616.2 U501.1(S_1) U501.2(S_2) U501.3(S_3) U502.2(S) U504.1(S_1) U504.2(S_2) U504.3(S_3) U505.2(S) U507.1(S_1) U507.2(S_2) U507.3(S_3) U509.1(S_1) U509.2(S_2) U509.3(S_3) U510.2(S) U512.1(S_1) U512.2(S_2) U512.3(S_3) U513.2(S) U515.1(S_1) U515.2(S_2) U515.3(S_3) U516.2(S) U518.2(S) U520.2(S) U522.2(S) U524.2(S) U526.1(S_1) U526.2(S_2) U526.3(S_3) U528.1(S_1) U528.2(S_2) U528.3(S_3) ZD500.1 ZD501.1 ZD502.1 ZD503.1 ZD504.1 ZD505.1 ZD506.1 ZD507.1 ZD508.1
VacL: B513.2(K) B516.2(K) B519.2(K) B522.2(K) B525.2(K) Q504.2(T2) Q506.2(T2) R593.2 R594.2 R606.2 R607.2 U517.6(com2) U517.7(nc) U519.2(nc) U519.3(com1) U519.6(com2) U519.7(nc) U521.2(nc) U521.3(com1) U521.6(com2) U521.7(nc) U523.2(nc) U523.3(com1) U523.6(com2) U523.7(nc) U525.2(nc) U525.3(com1) U525.6(com2) U525.7(nc) U527.2(nc) U527.3(com1) U527.6(com2) U527.7(nc)
VacN: CW527.3 TN500.4 TN500.6 TN500.8 TN500.10 TN500.12 TN500.14 U517.2(nc) U517.3(com1)
AO_AB212: IC500.5(2IN+) IC501.28(OUT1)
AO_AB221: IC501.22(OUT7) IC502.12(4IN+)
AO_AB232: IC500.3(1IN+) IC501.1(OUT0)
AO_MFC111: IC501.8(OUT9) IC503.3(1IN+)
AO_MFC121: IC501.9(OUT10) IC503.5(2IN+)
AO_P108: IC501.25(OUT4) IC502.5(2IN+)
AO_P341: IC500.10(3IN+) IC501.27(OUT2)
AO_P351: IC500.12(4IN+) IC501.10(OUT11)
AO_P370: IC501.24(OUT5) IC502.3(1IN+)
AO_P375: IC501.26(OUT3) IC503.12(4IN+)
AO_P380: IC501.23(OUT6) IC502.10(3IN+)
AO_SPARE1: IC501.11(OUT12) IC503.10(3IN+)
DAC_CS: IC501.3(SCL/~{CS})
DI_FIRE: CW527.2
DI_HT193_WD: B513.4(C) R562.2 Tp518.1(tp)
DI_HT194_WD: B516.4(C) R572.2 Tp523.1(tp)
DI_HT195_WD: B519.4(C) R581.2 Tp528.1(tp)
DI_HT196_WD: B522.4(C) R591.2 Tp532.1(tp)
DI_SPARE_WD: B525.4(C) R603.2 Tp537.1(tp)
DO_FAN504: R600.1 Tp535.1(tp)
DO_HT193: R568.1 Tp520.1(tp)
DO_HT193_AC: D513.1 TN500.3 U519.4(no) U519.5(no)
DO_HT194: R578.1 Tp526.1(tp)
DO_HT194_AC: D515.1 TN500.5 U521.4(no) U521.5(no)
DO_HT195: R587.1 Tp531.1(tp)
DO_HT195_AC: D517.1 TN500.7 U523.4(no) U523.5(no)
DO_HT196: R599.1 Tp534.1(tp)
DO_HT196_AC: D519.1 TN500.9 U525.4(no) U525.5(no)
DO_HT_SPEAR1: R612.1 Tp539.1(tp)
DO_IGN175: R598.1 Tp533.1(tp)
DO_MC_SW: R559.1 Tp514.1(tp)
DO_MV124: R570.1 Tp521.1(tp)
DO_MV131: R579.1 Tp525.1(tp)
DO_MV148: R545.1 Tp509.1(tp)
DO_MV150: R554.1 Tp512.1(tp)
DO_MV155: R510.1 Tp501.1(tp)
DO_MV158: R561.1 Tp515.1(tp)
DO_MV300: R523.1 Tp503.1(tp)
DO_MV390: R533.1 Tp505.1(tp)
DO_MV_SPARE: R588.1 Tp530.1(tp)
DO_OUT_IGN175: CW527.4 MF500.2 Q504.1(T1) R602.1
DO_SPARE: D522.1 TN500.11 U527.4(no) U527.5(no)
DO_SV102: R505.1 Tp500.1(tp)
DO_SV103: R514.1 Tp502.1(tp)
DO_SV125: R543.1 Tp508.1(tp)
DO_SV145: R526.1 Tp504.1(tp)
DO_SV149: R550.1 Tp511.1(tp)
DO_SV323: R535.1 Tp506.1(tp)
DO_SV_SPARE: R614.1 Tp540.1(tp)
DO_TRI: R608.1 Tp538.1(tp)
FAN_ERR: CW528.2
MS1: TN500.1 U517.4(no)
MS2: TN500.2 U517.5(no)
PAO_AB212: CW521.1 D501.1 R503.1 Tp522.1(tp)
PAO_AB221: CW524.1 D505.2 R517.1 Tp527.1(tp)
PAO_AB232: CW515.3 D501.2 R500.1 Tp517.1(tp)
PAO_MFC111: D509.2 R531.1
PAO_MFC121: D509.1 R538.1
PAO_P108: CW514.1 D506.1 R520.1 Tp513.1(tp)
PAO_P341: CW518.2 D502.1 R504.1 Tp519.1(tp)
PAO_P351: CW517.2 D502.2 R501.1 Tp516.1(tp)
PAO_P370: CW507.2 D506.2 R516.1 Tp507.1(tp)
PAO_P375: CW510.2 D508.2 R532.1 Tp510.1(tp)
PAO_P380: CW525.3 D505.1 R521.1 Tp529.1(tp)
PAO_SPARE1: CW522.2 D508.1 R539.1 Tp524.1(tp)
PDO_TRI: MF501.2 Q506.1(T1) R613.1 TN500.13
TC_SPI_CLK: IC501.4(SDA/SCLK)
TC_SPI_MISO: IC501.19(A1/SDO)
TC_SPI_MOSI: IC501.5(A0/SDI)
NetB500_1: B500.1(A) R505.2
NetB500_3: B500.3(E) R507.1
NetB501_1: B501.1(A) R510.2
NetB501_3: B501.3(E) R511.1
NetB502_1: B502.1(A) R514.2
NetB502_3: B502.3(E) R515.1
NetB503_1: B503.1(A) R523.2
NetB503_3: B503.3(E) R524.1
NetB504_1: B504.1(A) R526.2
NetB504_3: B504.3(E) R527.1
NetB505_1: B505.1(A) R533.2
NetB505_3: B505.3(E) R534.1
NetB506_1: B506.1(A) R535.2
NetB506_3: B506.3(E) R536.1
NetB507_1: B507.1(A) R543.2
NetB507_3: B507.3(E) R544.1
NetB508_1: B508.1(A) R545.2
NetB508_3: B508.3(E) R546.1
NetB509_1: B509.1(A) R550.2
NetB509_3: B509.3(E) R552.1
NetB510_1: B510.1(A) R554.2
NetB510_3: B510.3(E) R555.1
NetB511_1: B511.1(A) R559.2
NetB511_3: B511.3(E) Q500.1(B)
NetB511_4: B511.4(C) R557.1
NetB512_1: B512.1(A) R561.2
NetB512_3: B512.3(E) R563.1
NetB513_1: B513.1(A) R564.2
NetB514_1: B514.1(A) R568.2
NetB514_3: B514.3(E) Q501.1(B)
NetB514_4: B514.4(C) R567.1
NetB515_1: B515.1(A) R570.2
NetB515_3: B515.3(E) R571.1
NetB516_1: B516.1(A) R574.2
NetB517_1: B517.1(A) R578.2
NetB517_3: B517.3(E) Q502.1(B)
NetB517_4: B517.4(C) R576.1
NetB518_1: B518.1(A) R579.2
NetB518_3: B518.3(E) R580.1
NetB519_1: B519.1(A) R583.2
NetB520_1: B520.1(A) R587.2
NetB520_3: B520.3(E) Q503.1(B)
NetB520_4: B520.4(C) R586.1
NetB521_1: B521.1(A) R588.2
NetB521_3: B521.3(E) R589.1
NetB522_1: B522.1(A) R592.2
NetB523_1: B523.1(A) R599.2
NetB523_3: B523.3(E) Q505.1(B)
NetB523_4: B523.4(C) R596.1
NetB524_1: B524.1(A) R600.2
NetB524_3: B524.3(E) R601.1
NetB525_1: B525.1(A) R605.2
NetB526_1: B526.1(A) R612.2
NetB526_3: B526.3(E) Q507.1(B)
NetB526_4: B526.4(C) R610.1
NetB527_1: B527.1(A) R614.2
NetB527_3: B527.3(E) R615.1
NetC501_1: C501.1 IC501.21(REF)
NetCH500_1: CH500.1 U500.2
NetCH500_2: CH500.2 U500.1
NetCH502_1: CH502.1 U503.2
NetCH502_2: CH502.2 U503.1
NetCH504_1: CH504.1 U506.2
NetCH504_2: CH504.2 U506.1
NetCH506_1: CH506.1 U508.2
NetCH506_2: CH506.2 U508.1
NetCH508_1: CH508.1 U511.2
NetCH508_2: CH508.2 U511.1
NetCH512_1: CH512.1 U514.2
NetCH512_2: CH512.2 U514.1
NetCH522_1: CH522.1 ; harness ?.V1
NetCH522_2: CH522.2 ; harness ?.CM
NetCH525_1: CH525.1 ; harness ?.흑색
NetCH525_2: CH525.2 ; harness ?.청색
NetCH525_3: CH525.3 ; harness ?.21.
NetCH525_4: CH525.4 ; harness ?.23.
NetCH526_1: CH526.1 M507.3(T)
NetCH526_2: CH526.2 M507.2(S)
NetCH526_3: CH526.3 M507.1(R)
NetCW500_2: CW500.2 D500.1 LED500.2 U501.5(D_1) U501.6(D_2) U501.7(D_3) U501.8(D_4)
NetCW501_2: CW501.2 LED501.2 U502.3(D)
NetCW502_2: CW502.2 D503.1 LED502.2 U504.5(D_1) U504.6(D_2) U504.7(D_3) U504.8(D_4)
NetCW503_2: CW503.2 LED503.2 U505.3(D)
NetCW504_2: CW504.2 D504.1 LED504.2 U507.5(D_1) U507.6(D_2) U507.7(D_3) U507.8(D_4)
NetCW505_2: CW505.2 LED505.2 U510.3(D)
NetCW506_2: CW506.2 D507.1 LED506.2 U509.5(D_1) U509.6(D_2) U509.7(D_3) U509.8(D_4)
NetCW508_2: CW508.2 D510.1 LED508.2 U512.5(D_1) U512.6(D_2) U512.7(D_3) U512.8(D_4)
NetCW509_2: CW509.2 LED507.2 U513.3(D)
NetCW512_2: CW512.2 D511.1 LED509.2 U515.5(D_1) U515.6(D_2) U515.7(D_3) U515.8(D_4)
NetCW513_2: CW513.2 LED510.2 U516.3(D)
NetCW516_2: CW516.2 LED512.2 U518.3(D)
NetCW520_2: CW520.2 LED514.2 U520.3(D)
NetCW523_2: CW523.2 LED515.2 U522.3(D)
NetCW526_2: CW526.2 LED517.2 U524.3(D)
NetCW528_1: CW528.1 D520.1 LED520.2 U526.5(D_1) U526.6(D_2) U526.7(D_3) U526.8(D_4)
NetCW529_2: CW529.2 D523.1 LED522.2 U528.5(D_1) U528.6(D_2) U528.7(D_3) U528.8(D_4)
NetD512_1: D512.1 LED511.2 Q500.3(C) U517.1(coil+)
NetD513_2: D513.2 R564.1
NetD514_1: D514.1 LED513.2 Q501.3(C) U519.1(coil+)
NetD515_2: D515.2 R574.1
NetD516_1: D516.1 LED516.2 Q502.3(C) U521.1(coil+)
NetD517_2: D517.2 R583.1
NetD518_1: D518.1 LED518.2 Q503.3(C) U523.1(coil+)
NetD519_2: D519.2 R592.1
NetD521_1: D521.1 LED519.2 Q505.3(C) U525.1(coil+)
NetD522_2: D522.2 R605.1
NetD524_1: D524.1 LED521.2 Q507.3(C) U527.1(coil+)
NetIC500_1: IC500.1(1OUT) IC500.2(1IN-) R500.2
NetIC500_6: IC500.6(2IN-) IC500.7(2OUT) R503.2
NetIC500_8: IC500.8(3OUT) IC500.9(3IN-) R504.2
NetIC500_13: IC500.13(4IN-) IC500.14(4OUT) R501.2
NetIC501_20: IC501.20(~{RESET}) R508.1
NetIC502_1: IC502.1(1OUT) IC502.2(1IN-) R516.2
NetIC502_6: IC502.6(2IN-) IC502.7(2OUT) R520.2
NetIC502_8: IC502.8(3OUT) IC502.9(3IN-) R521.2
NetIC502_13: IC502.13(4IN-) IC502.14(4OUT) R517.2
NetIC503_1: IC503.1(1OUT) IC503.2(1IN-) R531.2
NetIC503_6: IC503.6(2IN-) IC503.7(2OUT) R538.2
NetIC503_8: IC503.8(3OUT) IC503.9(3IN-) R539.2
NetIC503_13: IC503.13(4IN-) IC503.14(4OUT) R532.2
NetIC504_1: IC504.1(A) R598.2
NetIC504_4: IC504.4(T1) Q504.3(G) R602.2
NetIC504_6: IC504.6(T2) R593.1
NetIC505_1: IC505.1(A) R608.2
NetIC505_4: IC505.4(T1) Q506.3(G) R613.2
NetIC505_6: IC505.6(T2) R606.1
NetLED500_1: LED500.1 R502.1
NetLED501_1: LED501.1 R506.1
NetLED502_1: LED502.1 R512.1
NetLED503_1: LED503.1 R518.1
NetLED504_1: LED504.1 R522.1
NetLED505_1: LED505.1 R529.1
NetLED506_1: LED506.1 R530.1
NetLED507_1: LED507.1 R542.1
NetLED508_1: LED508.1 R541.1
NetLED509_1: LED509.1 R549.1
NetLED510_1: LED510.1 R551.1
NetLED511_1: LED511.1 R558.1
NetLED512_1: LED512.1 R560.1
NetLED513_1: LED513.1 R566.1
NetLED514_1: LED514.1 R569.1
NetLED515_1: LED515.1 R577.1
NetLED516_1: LED516.1 R575.1
NetLED517_1: LED517.1 R584.1
NetLED518_1: LED518.1 R585.1
NetLED519_1: LED519.1 R595.1
NetLED520_1: LED520.1 R597.1
NetLED521_1: LED521.1 R609.1
NetLED522_1: LED522.1 R611.1
NetM500_1: M500.1(T) ; harness YH396-03.RED
NetM500_2: M500.2(SIG) ; harness ?.WHITE
NetM500_3: M500.3(R) ; harness ?.BLACK
NetM501_1: M501.1(T) ; harness YH396-03.RED
NetM501_2: M501.2(SIG) ; harness ?.WHITE
NetM501_3: M501.3(R) ; harness ?.BLACK
NetM502_1: M502.1(R) ; harness ?.BLACK
NetM502_3: M502.3(T) ; harness ?.RED
NetM503_1: M503.1(T) ; harness YH396-03.RED
NetM503_2: M503.2(SIG) ; harness ?.WHITE
NetM503_3: M503.3(R) ; harness ?.BLACK
NetM504_1: M504.1(T) ; harness YH396-03.RED
NetM504_2: M504.2(SIG) ; harness ?.WHITE
NetM504_3: M504.3(R) ; harness ?.BLACK
NetM506_1: M506.1(T) ; harness ?.U
NetM506_3: M506.3(R) ; harness ?.W
NetMF500_1: MF500.1 R594.1
NetMF501_1: MF501.1 R607.1
NetR507_2: R507.2 R509.1 U501.4(G)
NetR511_2: R511.2 R513.1 U502.1(G) ZD500.2
NetR515_2: R515.2 R519.1 U504.4(G)
NetR524_2: R524.2 R525.1 U505.1(G) ZD501.2
NetR527_2: R527.2 R528.1 U507.4(G)
NetR534_2: R534.2 R537.1 U510.1(G) ZD502.2
NetR536_2: R536.2 R540.1 U509.4(G)
NetR544_2: R544.2 R547.1 U512.4(G)
NetR546_2: R546.2 R548.1 U513.1(G) ZD503.2
NetR552_2: R552.2 R553.1 U515.4(G)
NetR555_2: R555.2 R556.1 U516.1(G) ZD504.2
NetR563_2: R563.2 R565.1 U518.1(G) ZD505.2
NetR571_2: R571.2 R573.1 U520.1(G) ZD506.2
NetR580_2: R580.2 R582.1 U522.1(G) ZD507.2
NetR589_2: R589.2 R590.1 U524.1(G) ZD508.2
NetR601_2: R601.2 R604.1 U526.4(G)
NetR615_2: R615.2 R616.1 U528.4(G)

Not connected (* = marked no-connect by the designer): CH501 1 2 3; CH503 1 2 3; CH505 1 2 3; CH507 1 2 3; CH509 1 2 3; CH510 1 2 3; CH511 1 2; CH513 1 2 3; CH514 1 2 3 4; CH515 1 2 3; CH516 1 2 3; CH517 1 2 3; CH518 1 2; CH519 1 2 3; CH520 1 2 3 4; CH521 1 2 3; CH523 1 2 3 4; CH524 1 2 3; CH527 1 2; CH?#1 1 2; CH?#2 1 2; CW522 4; IC501 6(FLEXIO) 7(OUT8) 12(OUT13) 13(OUT14) 14(OUT15); IC504 3(NC) 5(SUBSTRATE); IC505 3(NC) 5(SUBSTRATE); L500 1 2; L501 1 2; L502 1 2; L503 1 2; M505 1(R) 3(T); M506 2(SIG); V500 1(R) 3(T); V501 1(R) 3(T); V502 1(R) 3(T); V503 1(R) 3(T); V504 1(R) 3(T); V505 1(R) 3(T); V506 1(R) 3(T); V507 1(R) 3(T)

### Layout directives
rule Clearance Constraint [Clearance = 0.2mm]; rule Width Constraint [Pref Width = 0.5mm    Min Width = 0.2mm    Max Width = 1mm]; rule Routing Via Style [Pref Size = 0.8mm    Pref Hole Size = 0.5mm]: +3.3V, +5V, +24V, +24Vee, AGND, AO_AB212, AO_AB221, AO_AB232, AO_MFC111, AO_MFC121, AO_P108, AO_P341, AO_P351, AO_P370, AO_P375, AO_P380, AO_SPARE1, DAC_CS, DGND, DI_FIRE, DI_HT193_WD, DI_HT194_WD, DI_HT195_WD, DI_HT196_WD, DI_SPARE_WD, DO_FAN504, DO_HT193, DO_HT193_AC, DO_HT194, DO_HT194_AC, DO_HT195, DO_HT195_AC, DO_HT196, DO_HT196_AC, DO_HT_SPEAR1, DO_IGN175, DO_MC_SW, DO_MV124, DO_MV131, DO_MV148, DO_MV150, DO_MV155, DO_MV158, DO_MV300, DO_MV390, DO_MV_SPARE, DO_OUT_IGN175, DO_SPARE, DO_SV102, DO_SV103, DO_SV125, DO_SV145, DO_SV149, DO_SV323, DO_SV_SPARE, DO_TRI, FAN_ERR, FG, GND, Gnd_e, PAO_AB212, PAO_AB221, PAO_AB232, PAO_MFC111, PAO_MFC121, PAO_P108, PAO_P341, PAO_P351, PAO_P370, PAO_P375, PAO_P380, PAO_SPARE1, PDO_TRI, PG, TC_SPI_CLK, TC_SPI_MISO, TC_SPI_MOSI, VacL, VacN
rule Clearance Constraint [Clearance = 0.17mm]; rule Width Constraint [Pref Width = 0.3mm    Min Width = 0.17mm    Max Width = 1mm]; rule Routing Via Style [Pref Size = 0.5mm    Pref Hole Size = 0.3mm]: +3.3V, +5V, AGND, AO_AB212, AO_AB221, AO_AB232, AO_MFC111, AO_MFC121, AO_P108, AO_P341, AO_P351, AO_P370, AO_P375, AO_P380, AO_SPARE1, DAC_CS, TC_SPI_CLK, TC_SPI_MISO, TC_SPI_MOSI

### Notes on the sheet
- Output_Section.SchDoc
- (near U500) 가스 인입밸브 1
- (near V500) AOG 전동 밸브
- AT24-3T
- (near U503) 가스 인입밸브 2
- (near V501) 시설수 입구 전동 볼밸브
- ANODE 인입 솔레노이드 밸브
- (near V502) 배열 회수 입구 전동 볼 밸브
- DI Water TANK 드레인 솔레노이드 밸브
- (near V503) 개질가스 Bypass 전동 밸브
- STACK 1 냉각수 공급
- (near M500) 적색
- (near CH507) DC(+)
- 개질기 질소퍼지 솔레노이드 밸브
- (near M500) 백색
- (near M500) 흑색
- (near CH507) 0 ~ 5 V
- (near CH507) DC(-)
- 스텍 Anode 출구 전동밸브
- STACK 2 냉각수 공급
- (near M501) 백색
- (near M501) 적색
- (near CH510) DC(+)
- (near CH511) RED
- 가스 가압펌프
- 스택 질소퍼지 솔레노이드 밸브
- (near M501) 흑색
- (near CH510) 0 ~ 5 V
- (near CH510) DC(-)
- (near CH511) BLACK
- (near V505) AOG VENT 전동 밸브
- Prox 에어블로어
- Anode (RG) 냉각용 물펌프
- (near M503) 적색
- (near CH516) DC(+)
- (near M503) 백색
- (near M503) 흑색
- (near CH516) 0 ~ 5 V
- (near CH516) DC(-)
- (near V506) PNG 인입 밸브
- (near M504) AOG 냉각용 물펌프
- (near M504) 적색
- (near CH517) DC(+)
- (near CH518) RED
- (near M505) 스택 에어블로어
- (near M504) 백색
- (near M504) 흑색
- (near CH517) 0 ~ 5 V
- (near CH517) DC(-)
- (near CH518) BLACK
- (near CH?#2) GRAY
- (near V507) 개질 가스 인입 밸브
- (near CH520) 0 ~ 5 V
- (near CH520) DC(+)
- (near CH?#2) BLACK
- BLBD24
- 자체볼륨
- (near CH520) DC(-)
- 모터 인버터
- 개질기 버너 에어블로어
- (near CH522) 0 ~ 5V
- LSLV0008M101
- 개질수 펌프
- (near CH522) DC(-)
- T
- R
- LTS 상단 히터
- +24V 전원
- 전원 1
- AC(L)
- AC(N)
- LTS 하단 히터
- Prox 상단 히터
- (near R592) HL2-2CM-dc24v
- Prox 하단 히터
- AC출력 SPARE
- (near M507) 환기팬1
- (near CW527) 흑색
- FDU-520
- 7
- 화염 감지기
- 버너 점화트렌스
- RED
- YELLOW
- BLACK
- (near CH526) DC +24
- (near CH526) ERR
- (near CH526) DC(-)
- (near CW527) 청색
- 21
- 8
- 23
- 19
- 20
- TZI-5-15/100WE
- DO SPARE 24V
- Output_Section
- (in symbol MOTOR_3S) 3S; M
- (in symbol MOTOR_AO) +; M; -
- (in symbol MOTOR_DC) +; M; -
- (in symbol VALVE) V

### Library data of the parts
B500-B527 = PC357N14J00F: Integrated Circuit; Part No.: PC357N14J00F; Height: 3mm; Price: 81
C500-C504 = CS1608: Part No.: {Part No}; Price: 6
CH500 CH502 CH518 CH527 = CH396-02: 버너 급기 팬 (AB212 계열):  BLDC-24 AB212 DRIVER / 공기를 불어넣는 블로어/팬 제어 +24V / 출력단(자체볼륨).
  CH500 CH502 CH527: Price: 25
  CH518: Price: 50
CH501 CH503 CH505 CH509 CH513 CH515 CH519 CH521 CH524 CH526 = CH_03: Part No.: {Value}; Price: {Price}
CH504 CH506 CH508 CH512 CH522 = CH396-02
  CH504 CH506 CH508 CH512: Price: 25
  CH522: Price: {Price}
CH507 CH510 = CH396-03: 역할: 촉매 반응(SR)에 필요한 물 공급량을 MFM2309 피드백 값과 비교하면서 PID로 밀어주는 핵심 아날로그 출력; Part No: {Part No}; BOP No: P321; Price: {Price}
CH511 = CH396-02: Part No.: BLDC-24&MS-BLP-8080; Price: {Price}
CH514 CH520 CH523 = CH396-04: 개질수 펌프 / GA-V21-DEMSE, Pump Head (GA-V21.JVS.SE); Price: {Price}
CH516 = CH396-03: 출력 규격: PWM 또는 0 ~ 5V / 역할: 촉매 반응(SR)에 필요한 물 공급량을 MFM2309 피드백 값과 비교하면서 PID로 밀어주는 핵심 아날로그 출력; Part No: {Part No}; BOP No: P422; Price: {Price}
CH517 = CH396-03: 출력 규격: PWM 또는 0 ~ 5V / 역할: 촉매 반응(SR)에 필요한 물 공급량을 MFM2309 피드백 값과 비교하면서 PID로 밀어주는 핵심 아날로그 출력; Part No: {Part No}; BOP No: P432; Price: {Price}
CH525 = CH396-04: (점화 이그나이터 제어) / TZI 5-15/100WE; Price: {Price}
CH?#1 CH?#2 = CH_02: Part No.: {Value}; Price: {Price}
CW500 CW529 = YW396-02: 가스 인입밸브 1; Price: 25
CW501 CW503 CW505 CW509 CW513 CW516 CW520 CW523 CW526 CW528 = SMW250-03D: FAN503 / (환기팬 / 모델명: D12BH-24): / 24V 구동 팬으로, 단순 On/Off가 아니라 시스템 내부 열을 식히기 위해 MCU가 PWM 듀티 비(Duty Cycle)를 조절해 속도를 실시간으로 가변 제어해야 하는 대표적인 고속 스위칭 특성 장치야.; Name: {Name}; Price: 31.2
CW502 = YW396-02: 가스 인입밸브 2; Price: 25
CW504 = YW396-02: 스택 Anode 입구 솔레노이드 밸브; Price: 25
CW506 = YW396-02: COGEN 배수(Drain) 솔레노이드 밸브; Price: 25
CW508 = YW396-02: 개질기 질소퍼지 솔레노이드 밸브; Price: 25
CW512 = YW396-02: 스택 질소퍼지 솔레노이드 밸브; Price: 25
CW514 CW521 = SMW250-02D: Name: {Name}; Price: 25; Part No.: SMW250-02D
CW515 CW522 CW525 = YW396-04: 개질수 펌프 / GA-V21-DEMSE, Pump Head (GA-V21.JVS.SE); Price: 35
  CW522: BOP No: *
CW519 = YW396-02: Part No.: yw396-02V; Price: 25
CW527 = YW396-04: (점화 이그나이터 제어); Price: 35
D501 D502 D505 D506 D508 D509 = TVS_23: Price: 370
IC500 IC502 IC503 = TLV2374ID: Integrated Circuit; Height: 1.75mm; Part No.: TLV2374ID; Price: 520
IC501 = DAC60516RUYT: Integrated Circuit; Height: 0.8mm; Part No.: DAC60516RUYT; Price: 35800
IC504 IC505 = MOC3063S: Integrated Circuit; Manufacturer_Name: Lite-On; Datasheet Link: http://optoelectronics.liteon.com/upload/download/DS70-2001-026/MOC306X%20series%20201606.pdf; Height: 4.6mm; Part No.: MOC3063S; Mouser Part Number: 859-MOC3063S; Mouser Price/Stock: https://www.mouser.co.uk/ProductDetail/Lite-On/MOC3063S?qs=3iY3Mti5Ubng7p%252BRxiBBuQ%3D%3D; Arrow Part Number: MOC3063S; Price: 210
L500 = HEAT: SH 상단 히터; Price: {Price}
L501 = HEAT: SH 하단 히터; Price: {Price}
L502 = HEAT: Prox 상단 히터; Price: {Price}
L503 = HEAT: Prox 하단 히터; Price: {Price}
LED500-LED522 = LED1608: Part No.: BL-HUF35A-AV-TRB; Name: {Name}; Price: 50
M500 M501 M503 M504 = MOTOR_AO: Price: {Price}
M502 = MOTOR_DC: 가스 가압펌프 / PM33098-838.1.2 / 0~5V 출력 가변; Price: {Price}
M505 = MOTOR_DC: Price: {Price}
M506 = MOTOR_AO: 버너 에어블로어; Price: {Price}
MF500 MF501 = MF104_FLIKO: Part No.: {Part No}; Price: 60
R500 R501 R503 R504 R516 R517 R520 R521 R531 R532 R538 R539 = R1608: Part No.: WR06X101JT(100R)J; Price: 1
R502 R508 R512 R522 R530 R541 R549 R558 R566 R575 R585 R595 R597 R609 R611 = R1608: Part No.: WR06X332JT(3.3KR)J; Price: 1.0
R505 R510 R514 R523 R526 R533 R535 R543 R545 R550 R554 R559 R561 R568 R570 R578 R579 R587 R588 R598-R600 R608 R612 R614 = R1608: Part No.: WR06X471JT(470R)J; Price: 1.0
R506 R507 R509 R511 R513 R515 R518 R519 R524 R525 R527-R529 R534 R536 R537 R540 R542 R544 R546-R548 R551-R553 R555-R557 R560 R563 R565 R567 R569 R571 R573 R576 R577 R580 R582 R584 R586 R589 R590 R596 R601 R604 R610 R615 R616 = R1608: Part No.: 'WR06X103JT(10KR)J; Price: 1
R562 R572 R581 R591 R603 = R1608: Part No.: WR06X202JT(2KR)J; Price: 1
R564 R574 R583 R592 R605 = R1608: Part No.: {Part No}; Price: {Price}
R593 R602 R606 R613 = R3216: Part No.: {Part No}; Price: {Price}
R594 R607 = R1_1: Part No.: {Part No}; Price: 35
TN500 = TERMINAL-14P: Price: 1620
Tp500-Tp535 Tp537-Tp540 = Tp_5000: Pad30; Part No.: C5000; Price: 360
U500 = COIL: 가스 인입밸브 1; Price: {Price}
U501 U504 U507 U509 U512 U515 U526 U528 = FET_IRF7413: Integrated Circuit; Height: 1.75mm; Price: 570
U503 = COIL: 가스 인입밸브 2; Price: {Price}
U506 U508 U511 U514 = COIL: 스택 Anode 입구 솔레노이드 밸브; Price: {Price}
U517 U519 = RY_HL2-2CM: 부품 명칭: 개질기 라인 스타트 히터 (Reformer Line Start Heater / 가열용 히터) / 시스템 내 역할: 시스템이 처음 가동될 때 개질기(Reformer) 및 관련 공급 배관 내부의 온도를 빠르게 예열해 주는 기동용 메인 전기 히터; Price: 1200
U521 = RY_HL2-2CM: 부품 명칭: 스택 프리히터 (Stack Pre-heater / 스택 예열용 히터) / 시스템 내 역할: 연료전지 시스템의 심장인 스택(Stack) 내부 또는 스택으로 유입되는 냉각수 배관 라인을 기동 초기에 빠르게 예열해 주는 대용량 전기 히터야.; Price: 1200
U523 = RY_HL2-2CM: 부품 명칭: 개질기 물 공급 예열 히터 (Reformer Water Pre-heater / 수분 가열 히터) / 시스템 내 역할: 개질기로 유입되는 반응용 순수(DI Water) 배관 라인을 기동 초기에 미리 뜨겁게 데워주는 전기 히터야.; Price: 1200
U525 = RY_HL2-2CM: 부품 명칭: 개질기 수증기 과열 히터 (Steam Super-heater / 가스·수증기 과열기) / 시스템 내 역할: HT2704를 거쳐서 기화되기 시작한 수증기와 원료 가스(PNG)의 혼합물을, 개질기 촉매단에 들어가기 바로 직전에 완벽한 고온의 '과열 증기(Superheated Steam)' 상태로 만들어주는 최종 가열 히터; Price: 1200
U527 = RY_HL2-2CM: 부품 명칭: 스택 동파 방지 및 보온 히터 (Stack Enclosure Heater / 스택 보온 히터) / 시스템 내 역할: 연료전지 시스템이 발전하지 않고 대기(Stand-by) 중이거나, 겨울철에 시스템이 정지(Shutdown)해 있을 때 스택 내부의 잔존 수분이 얼어 터지는 것을 막고 최적 온도를 유지해 주는 방한 히터; Price: 1200
V500-V507 = VALVE: Price: {Price}
ZD500-ZD508 = ZD_3216: 24V/0.5A; Part No.: CZRW5240B-G; Price: 50
CW507 CW510 CW517 CW518 = YW396-03: Part No.: YW396-03; Price: 23
CW511 CW524 = YW396-02: Price: 25
D500 D503 D504 D507 D510-D524 = MINI-SMA
  D500 D503 D504 D507 D510-D512 D514 D516 D518 D521 D524: Price: 30
  D513 D515 D517 D519 D520 D522 D523: Price: {Price}
M507 = MOTOR_3S: Price: {Price}
Q500-Q503 Q505 Q507 = TR23RN: Price: 35
Q504 = TRIAC_220S: Price: 200
Q506 = TRIAC_220HT: Price: 800
U502 U505 U510 U513 U516 U518 U520 U522 U524 = FET23_N: Price: 80